# Altium schematic sheet MOTORS.SchDoc
size A
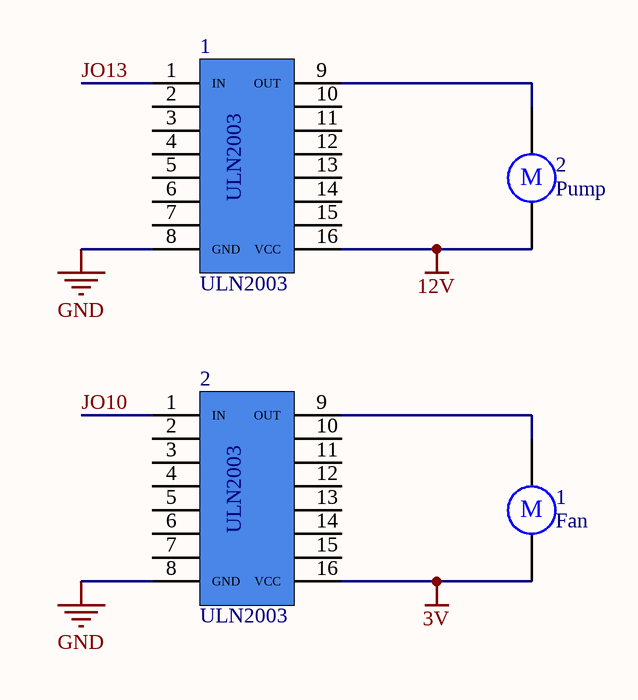
[diagram p0: MOTORS.SchDoc]

## Parts
(Parts that share a designator on the sheet are numbered #1, #2 ... from top to bottom, then left to right.)
1#1  ULN2003
1#2  Fan  [RB5-10.5]
2#1  Pump  [RB5-10.5]
2#2  ULN2003

## Nets
3V: 1#2.2 2#2.16(VCC)
12V: 1#1.16(VCC) 2#1.2
GND: 1#1.8(GND) 2#2.8(GND)
JO10: 2#2.1(IN)
JO13: 1#1.1(IN)
Net1#1_9: 1#1.9(OUT) 2#1.1
Net1#2_1: 1#2.1 2#2.9(OUT)

Not connected (* = marked no-connect by the designer): 1#1 2 3 4 5 6 7 10 11 12 13 14 15; 2#2 2 3 4 5 6 7 10 11 12 13 14 15

## Notes on the sheet
- (in symbol Motor) M

## Library data of the parts
1#2 2#1 = Motor: Motor, General Kind; Published: 24-Mar-1999; LatestRevisionDate: 17-Jul-2002; LatestRevisionNote: Re-released for DXP Platform.; PackageReference: RB5-10.5; Publisher: Altium Limited; PackageDescription: Capacitor (Radial); 2 Leads